# EAGLE design charlieplex_12 (EAGLE 5.11)
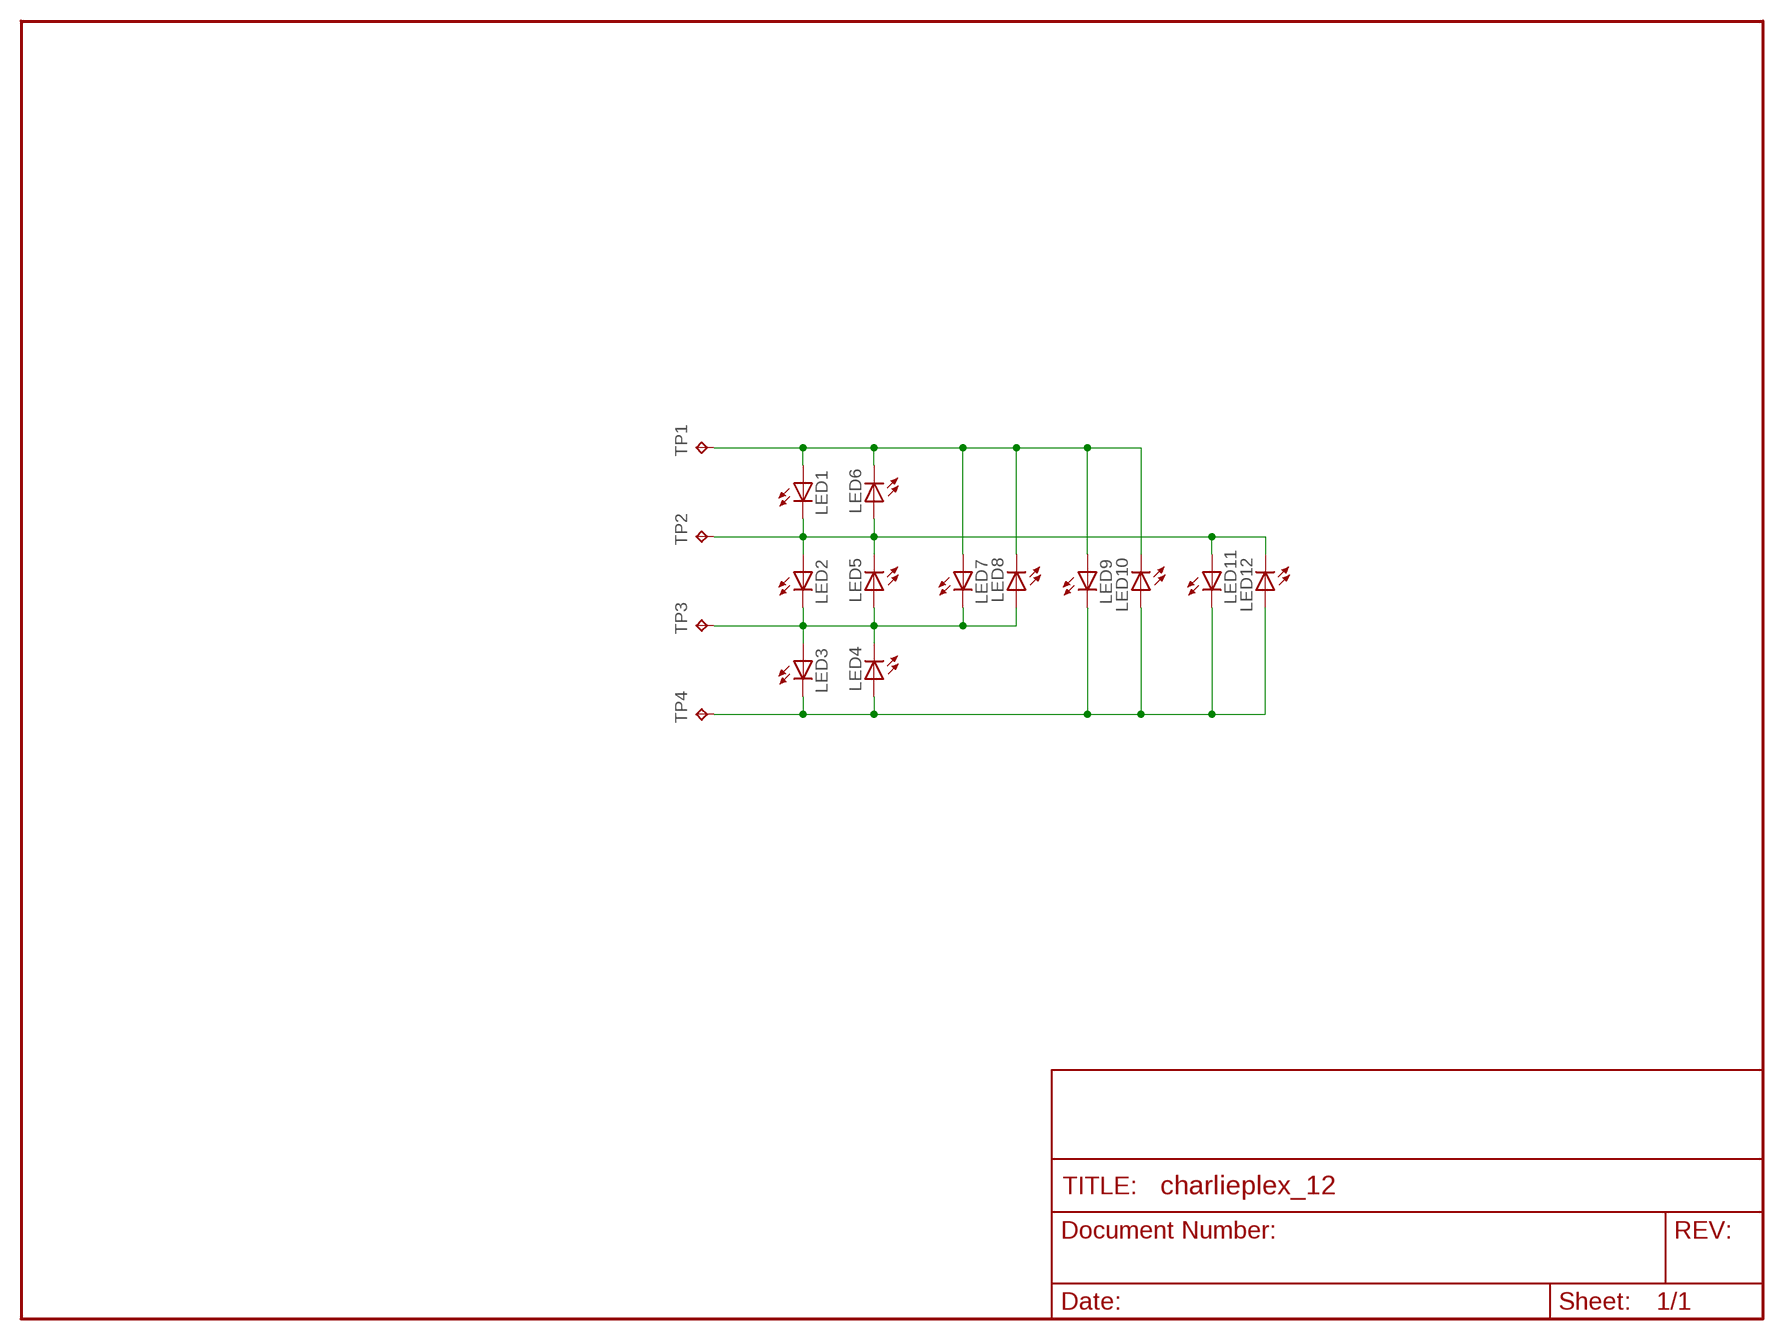
[diagram p0: schematic, sheet 1]

## Parts
LED1  LED0805  [LED_0805]
LED2  LED0805  [LED_0805]
LED3  LED0805  [LED_0805]
LED4  LED0805  [LED_0805]
LED5  LED0805  [LED_0805]
LED6  LED0805  [LED_0805]
LED7  LED0805  [LED_0805]
LED8  LED0805  [LED_0805]
LED9  LED0805  [LED_0805]
LED10  LED0805  [LED_0805]
LED11  LED0805  [LED_0805]
LED12  LED0805  [LED_0805]
TP1  TEST_POINTPAD1-20  [P1-20]
TP2  TEST_POINTPAD1-20  [P1-20]
TP3  TEST_POINTPAD1-20  [P1-20]
TP4  TEST_POINTPAD1-20  [P1-20]

## Nets
N$1: LED1.A LED6.C LED7.A LED8.C LED9.A LED10.C TP1.TP
N$2: LED1.C LED2.A LED5.C LED6.A LED11.A LED12.C TP2.TP
N$5: LED2.C LED3.A LED4.C LED5.A LED7.C LED8.A TP3.TP
N$6: LED3.C LED4.A LED9.C LED10.A LED11.C LED12.A TP4.TP

## Library data of the parts
LED1-LED12 = CyberRailGuru:LED: LEDs Standard schematic elements and footprints for 5mm, 3mm, 1206, and 0603 sized LEDs. 5mm - Spark Fun Electronics SKU : COM-00529 (and others)
TP1-TP4 = CyberRailGuru:TEST_POINT: Test pad

## Board
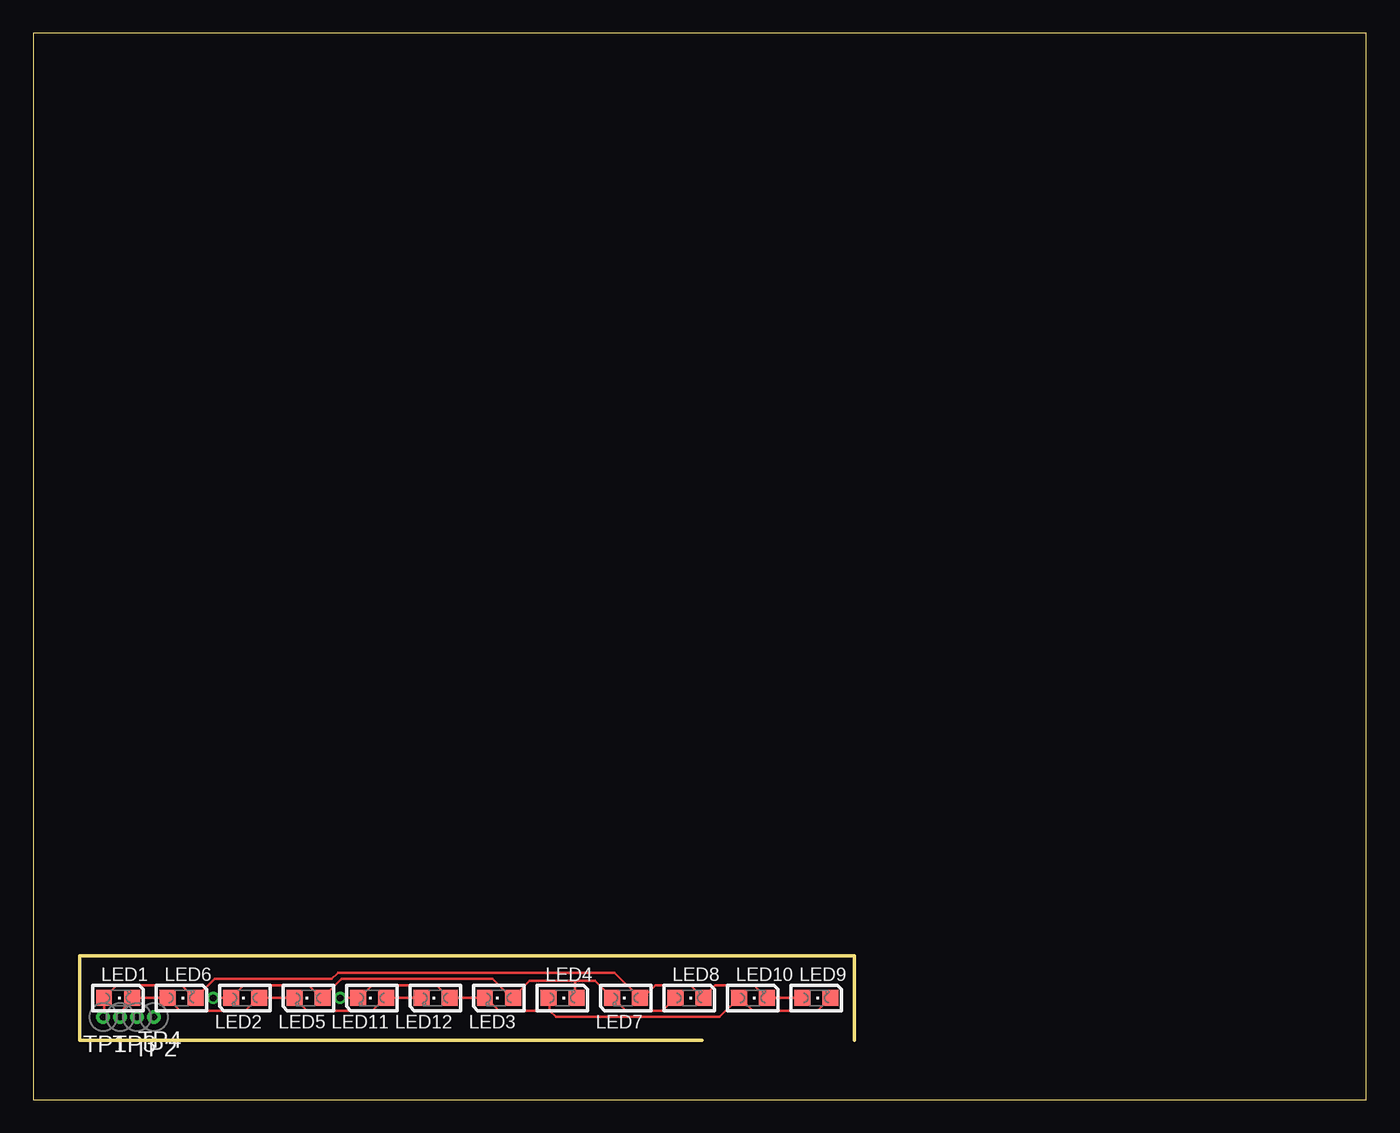
[diagram p1: board, top side]
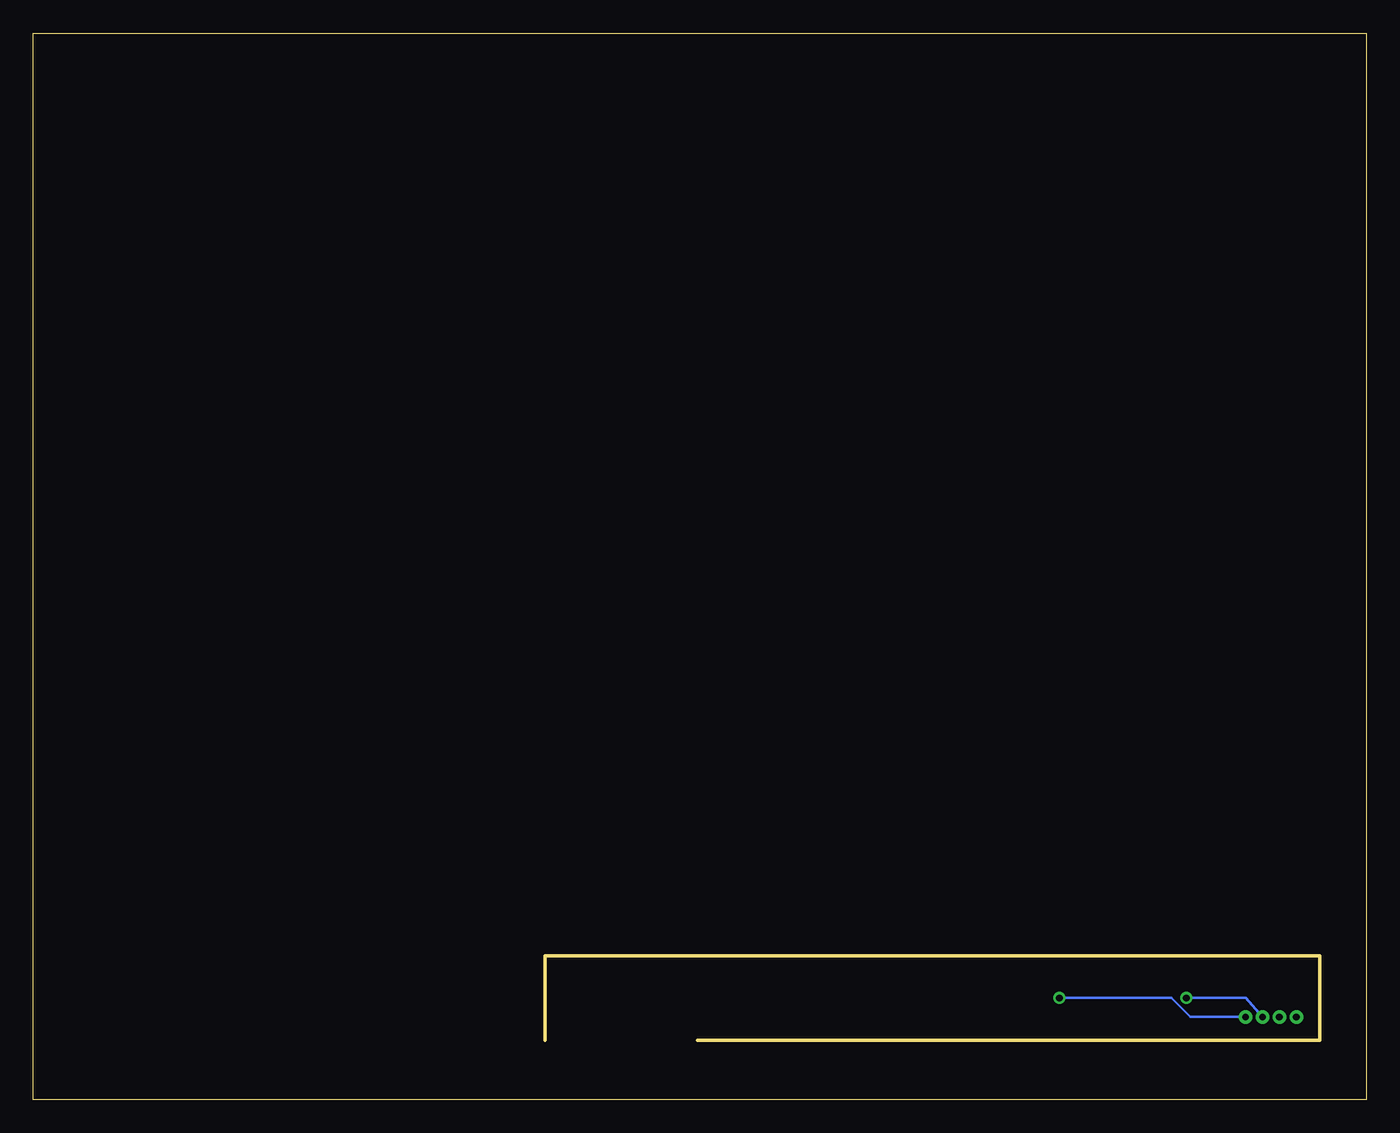
[diagram p2: board, bottom side, seen from below]

Size 100 x 80 mm. Coordinates in mm from the lower left corner, seen from the top.
Outline: 61.59,4.45 61.59,10.79 3.49,10.79 3.49,4.45 50.16,4.45
Outline: 0,0 100,0 100,80 0,80 0,0
Copper layers (1*16): Top 0.035mm / dielectric 1.5mm / Bottom 0.035mm
Design rules "default *": minimum track width 8mil, minimum drill 20mil, track to track 8mil, track to pad 8mil, pad to pad 8mil, via to via 8mil, smd to smd 8mil, copper to edge 40mil, drill to drill 8mil, minimum pad ring 10mil, minimum via ring 8mil, stop-mask expansion 4mil, vias tented up to drill 0mil, thermal gap 10mil

### Footprints (pad centres in the part's own frame; a part is rotated, then mirrored left to right if it is on the bottom)
LED_0805 = smd 1.2 x 1.2: A 0,-1.05; C 0,1.05
P1-20 = drill 0.508 round: TP 0,0

### Placement (x,y rotation side)
LED1  6.35,7.62 270 top
LED2  15.88,7.62 90 top
LED3  34.92,7.62 90 top
LED4  39.69,7.62 270 top
LED5  20.64,7.62 90 top
LED6  11.11,7.62 270 top
LED7  44.45,7.62 90 top
LED8  49.21,7.62 270 top
LED9  58.74,7.62 270 top
LED10  53.98,7.62 270 top
LED11  25.4,7.62 90 top
LED12  30.16,7.62 90 top
TP1  5.24,6.19 0 top
TP2  6.51,6.19 0 top
TP3  7.78,6.19 0 top
TP4  9.05,6.19 0 top

### Tracks (layer width: path | path; a pad name or v marks a point on that pad's centre or on a via)
N$1
  Top 0.203: TP1.TP 5.3,6.35 LED1.A 6.25,8.57 11.11,8.57 12.06,7.62 LED6.C 13.59,9.05 22.38,9.05 22.86,9.53 43.59,9.53 LED7.A 45.72,7.62 46.67,8.57 49.31,8.57 LED8.C 50.48,7.62 50.48,7.91 51.15,8.57 54.07,8.57 LED10.C LED9.A
N$2
  Top 0.203: LED6.A LED1.C 7.3,7.62 6.51,6.35 TP2.TP | 10.16,7.62 LED6.A | LED6.A 11.02,6.67 13.81,6.67 14.29,6.67 15.88,6.67 16.83,7.62 LED2.A LED5.C 20.54,6.67 25.4,6.67 26.35,7.62 LED11.A LED12.C
N$5  (via drill 0.51)
  Top 0.203: 40.64,8.89 37.24,8.89 LED3.A 35.88,7.62 34.45,9.05 23.12,9.05 LED5.A 21.59,7.62 20.64,8.57 15.78,8.57 LED2.C 13.65,7.62 v13.49,7.62 | 40.64,8.89 40.64,7.62 LED4.C | LED8.A 47.21,6.67 44.45,6.67 43.5,7.62 LED7.C 42.13,8.89 40.64,8.89
  Bottom 0.203: v13.49,7.62 9.05,7.62 TP3.TP
N$6  (via drill 0.51)
  Top 0.203: 38.73,6.67 34.92,6.67 33.97,7.62 LED3.C LED12.A 30.26,8.57 25.4,8.57 24.45,7.62 LED11.C v23.02,7.62 | LED4.A 38.73,7.62 38.73,6.67 | 38.73,6.67 39.21,6.19 51.5,6.19 LED10.A 53.02,7.62 53.98,6.67 58.84,6.67 LED9.C
  Bottom 0.203: TP4.TP 13.18,6.19 14.61,7.62 v23.02,7.62